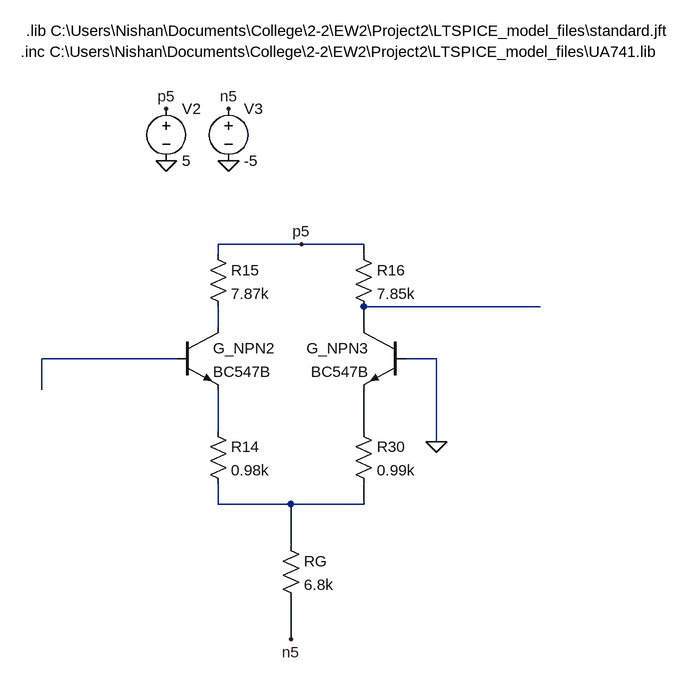
[diagram p0: schematic PreAmp.asc]
PreAmp.asc, the LTspice schematic file:
Version 4.1
SHEET 1 4496 2220
WIRE 224 368 96 368
WIRE 320 368 224 368
WIRE 96 384 96 368
WIRE 320 384 320 368
WIRE 592 464 320 464
WIRE 96 496 96 464
WIRE 320 496 320 464
WIRE 32 544 -176 544
WIRE 432 544 384 544
WIRE -176 592 -176 544
WIRE 96 656 96 592
WIRE 320 656 320 592
WIRE 432 672 432 544
WIRE 96 768 96 736
WIRE 208 768 96 768
WIRE 320 768 320 736
WIRE 320 768 208 768
WIRE 208 832 208 768
WIRE 208 976 208 912
FLAG 16 240 0
FLAG 112 240 0
FLAG 16 160 p5
FLAG 112 160 n5
FLAG 208 976 n5
FLAG 224 368 p5
FLAG 432 672 0
DATAFLAG 512 464 ""
DATAFLAG 208 768 ""
SYMBOL voltage 16 144 R0
WINDOW 123 0 0 Left 0
WINDOW 39 0 0 Left 0
SYMATTR InstName V2
SYMATTR Value 5
SYMBOL voltage 112 144 R0
WINDOW 123 0 0 Left 0
WINDOW 39 0 0 Left 0
SYMATTR InstName V3
SYMATTR Value -5
SYMBOL npn 32 496 R0
SYMATTR InstName G_NPN2
SYMATTR Value BC547B
SYMBOL npn 384 496 M0
SYMATTR InstName G_NPN3
SYMATTR Value BC547B
SYMBOL res 192 816 R0
SYMATTR InstName RG
SYMATTR Value 6.8k
SYMBOL res 80 368 R0
SYMATTR InstName R15
SYMATTR Value 7.87k
SYMBOL res 304 368 R0
SYMATTR InstName R16
SYMATTR Value 7.85k
SYMBOL res 80 640 R0
SYMATTR InstName R14
SYMATTR Value 0.98k
SYMBOL res 304 640 R0
SYMATTR InstName R30
SYMATTR Value 0.99k
TEXT -200 40 Left 2 !.lib C:\\Users\\Nishan\\Documents\\College\\2-2\\EW2\\Project2\\LTSPICE_model_files\\standard.jft
TEXT -208 72 Left 2 !.inc C:\\Users\\Nishan\\Documents\\College\\2-2\\EW2\\Project2\\LTSPICE_model_files\\UA741.lib

The netlist it stands for:
* PreAmp.asc
V2 p5 0 5
V3 n5 0 -5
Q§G_NPN2 N002 N003 N004 0 BC547B
Q§G_NPN3 N001 0 N005 0 BC547B
RG N006 n5 6.8k
R15 p5 N002 7.87k
R16 p5 N001 7.85k
R14 N004 N006 0.98k
R30 N005 N006 0.99k
.model NPN NPN
.model PNP PNP
.lib standard.bjt
.lib C:\Users\Nishan\Documents\College\2-2\EW2\Project2\LTSPICE_model_files\standard.jft
.inc C:\Users\Nishan\Documents\College\2-2\EW2\Project2\LTSPICE_model_files\UA741.lib
.backanno
.end